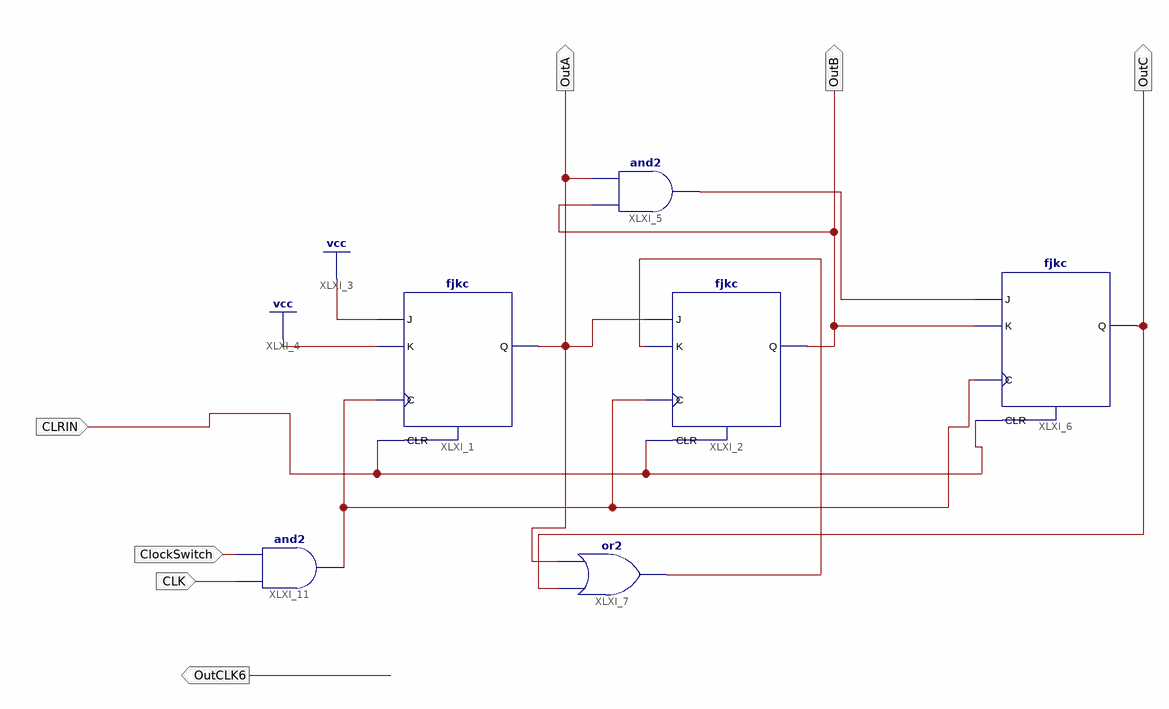
[diagram p0: schematic sheet 1]
// Xilinx ISE schematic counter1_6x6.sch (spartan6) as structural Verilog: 6 symbols, 7 ports
module counter1_6x6 (
  input  ClockSwitch,
  input  CLK,
  input  CLRIN,
  output OutB,
  output OutC,
  output OutA,
  output OutCLK6
);

  wire XLXN_3, XLXN_4, XLXN_7;

  fjkc XLXI_1 (.C(XLXN_7), .CLR(CLRIN), .J(1'b1), .K(1'b1), .Q(OutA));
  fjkc XLXI_2 (.C(XLXN_7), .CLR(CLRIN), .J(OutA), .K(XLXN_4), .Q(OutB));
  and XLXI_5 (XLXN_3, OutB, OutA);
  fjkc XLXI_6 (.C(XLXN_7), .CLR(CLRIN), .J(XLXN_3), .K(OutB), .Q(OutC));
  or XLXI_7 (XLXN_4, OutC, OutA);
  and XLXI_11 (XLXN_7, CLK, ClockSwitch);
endmodule
